# Altium schematic sheet AC_REMOTE.SchDoc
size A3; SheetNumber: 1; SheetTotal: 2
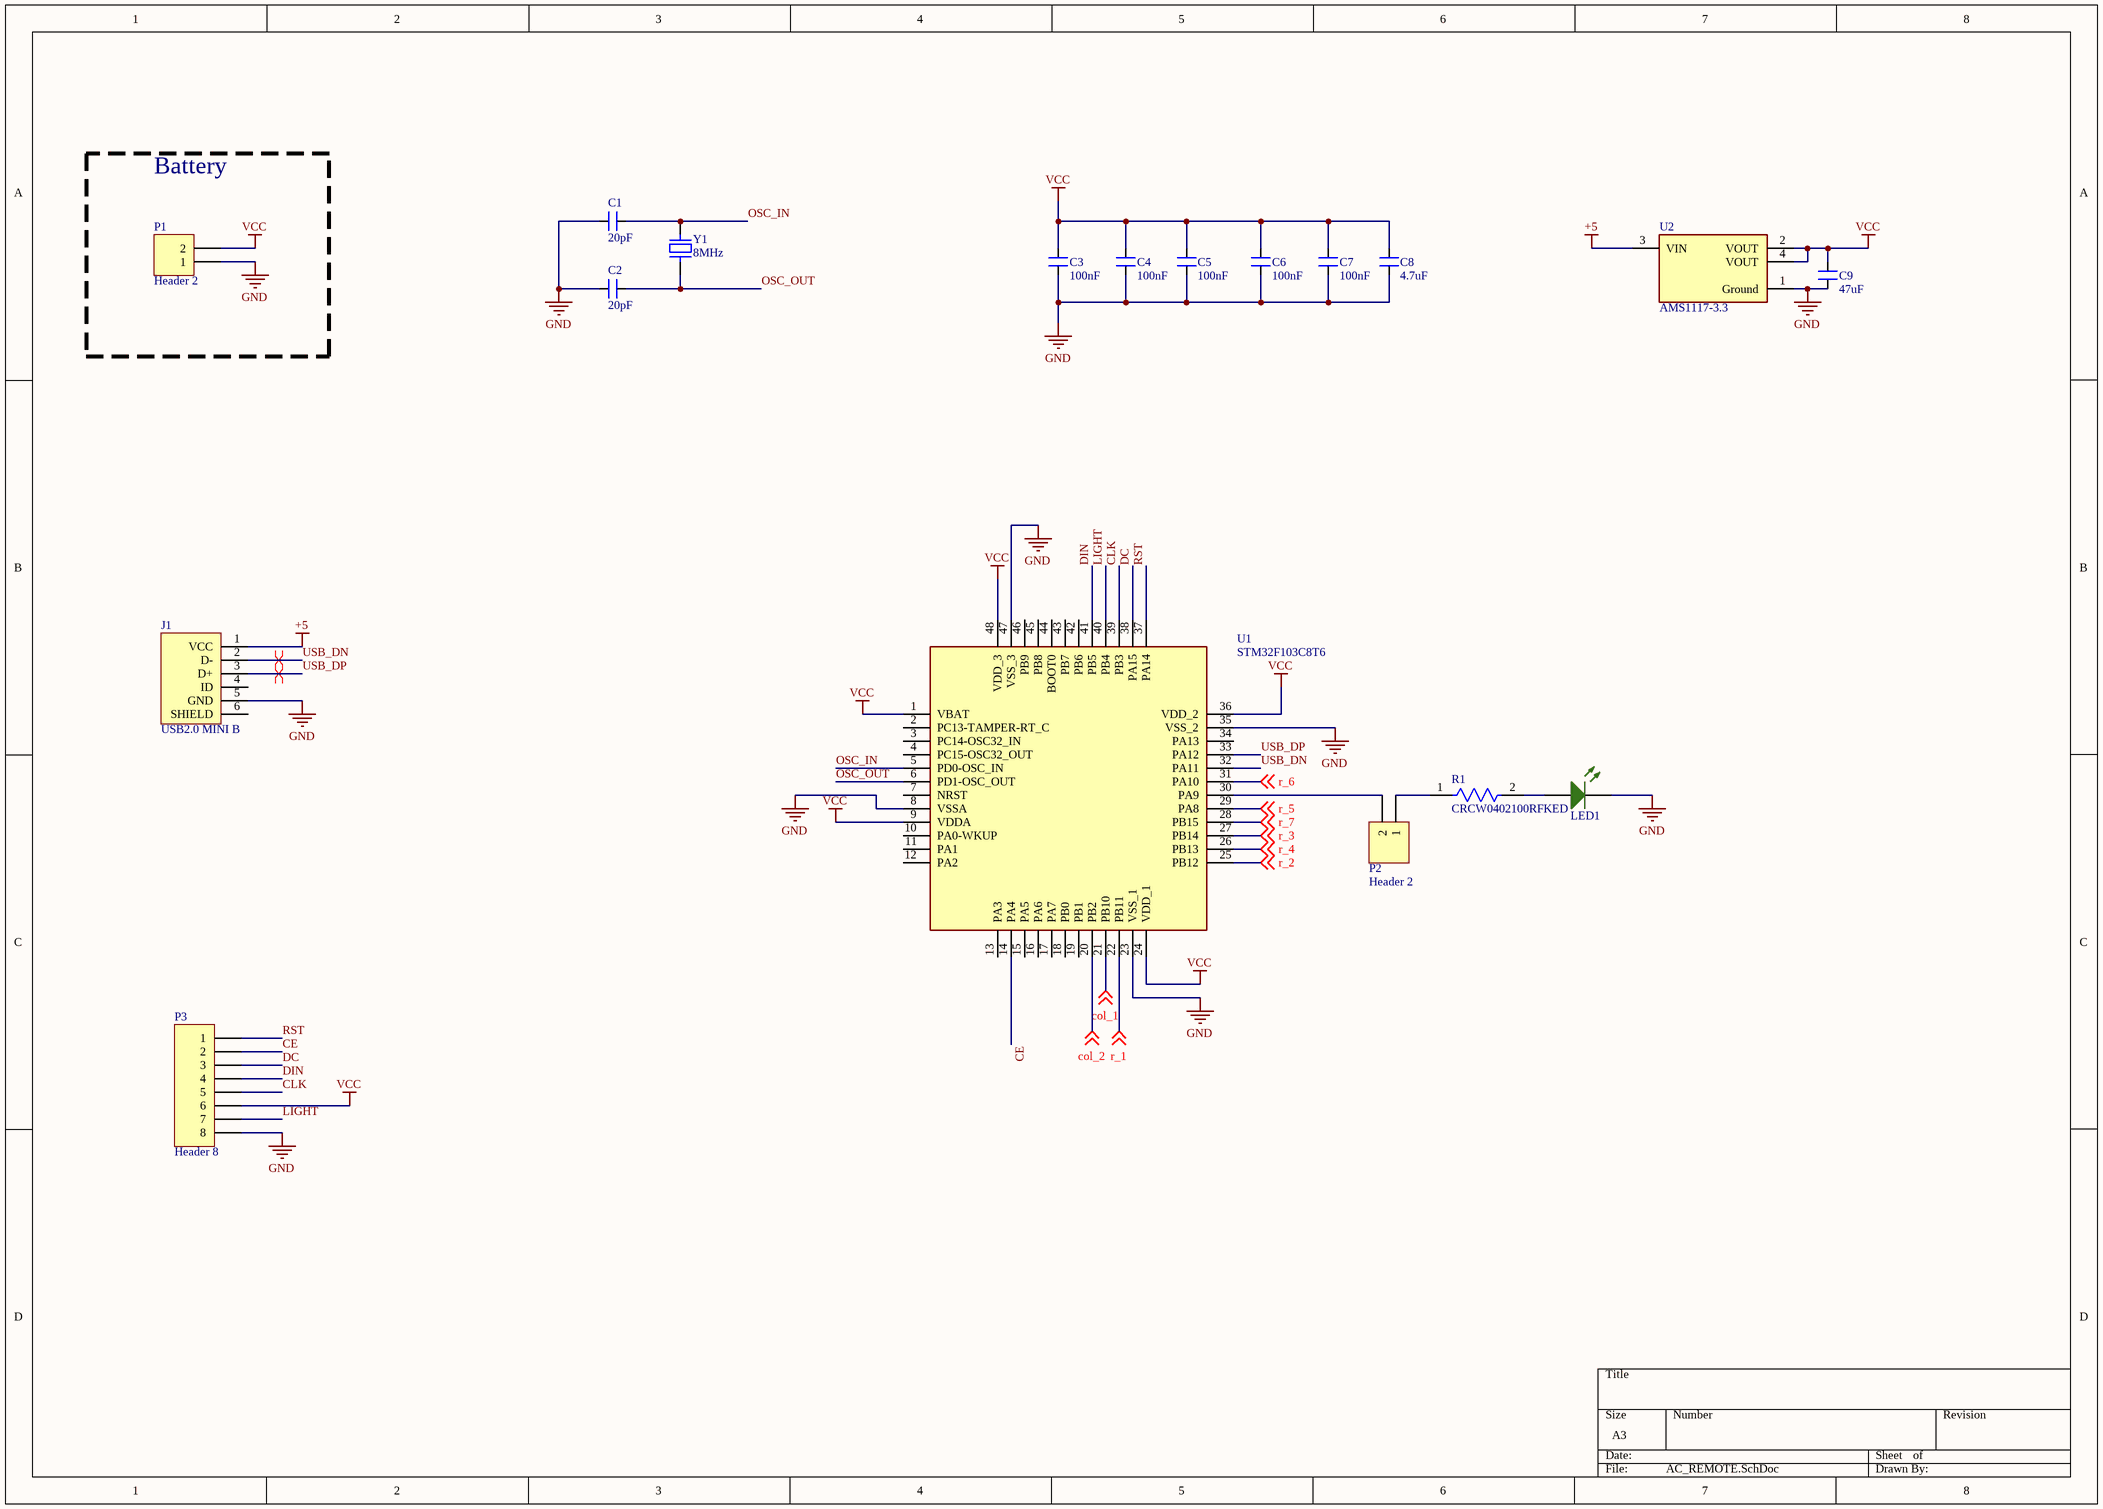
[diagram p0: AC_REMOTE.SchDoc]

## Parts
C1  20pF  [CAP_0805]
C2  20pF  [CAP_0805]
C3  100nF  [CAP_0805]
C4  100nF  [CAP_0805]
C5  100nF  [CAP_0805]
C6  100nF  [CAP_0805]
C7  100nF  [CAP_0805]
C8  4.7uF  [CAP_0805]
C9  47uF  [CAP_0805]
J1  USB2.0 MINI B  [CON_690-005-299-043]
LED1  LED THD 5mm GREEN  [LED_5MM_GREEN]  (value not drawn)
P1  Header 2  [HDR1X2]
P2  Header 2  [HDR1X2]
P3  Header 8  [HDR1X8]
R1  CRCW0402100RFKED  [FP-CRCW0402-e3-IPC_C]
U1  STM32F103C8T6  [LQFP-48_19.6_393_58X11_SMD]
U2  AMS1117-3.3  [FP-AMS1117-IPC_C]
Y1  8MHz  [HC-49S SMD]

## Blocks framed on the sheet
Battery: P1

## Nets
+5: J1.1(VCC) U2.3(VIN)
GND: C1.1 C2.1 C3.1 C4.1 C5.1 C6.1 C7.1 C8.2 C9.1 J1.5(GND) LED1.2(K) P1.1 P3.8 U1.8(VSSA) U1.23(VSS_1) U1.35(VSS_2) U1.47(VSS_3) U2.1(Ground)
VCC: C3.2 C4.2 C5.2 C6.2 C7.2 C8.1 C9.2 P1.2 P3.6 U1.1(VBAT) U1.9(VDDA) U1.24(VDD_1) U1.36(VDD_2) U1.48(VDD_3) U2.2(VOUT) U2.4(VOUT)
CE: P3.2 U1.14(PA4)
CLK: P3.5 U1.39(PB3)
col_1: U1.21(PB10) ; off-sheet col_1
col_2: U1.20(PB2) ; off-sheet col_2
DC: P3.3 U1.38(PA15)
DIN: P3.4 U1.41(PB5)
LIGHT: P3.7 U1.40(PB4)
OSC_IN: C1.2 U1.5(PD0-OSC_IN) Y1.2
OSC_OUT: C2.2 U1.6(PD1-OSC_OUT) Y1.1
r_1: U1.22(PB11) ; off-sheet r_1
r_2: U1.25(PB12) ; off-sheet r_2
r_3: U1.27(PB14) ; off-sheet r_3
r_4: U1.26(PB13) ; off-sheet r_4
r_5: U1.29(PA8) ; off-sheet r_5
r_6: U1.31(PA10) ; off-sheet r_6
r_7: U1.28(PB15) ; off-sheet r_7
RST: P3.1 U1.37(PA14)
USB_DN: J1.2(D-) U1.32(PA11)
USB_DP: J1.3(D+) U1.33(PA12)
NetLED1_1: LED1.1(A) R1.2
NetP2_1: P2.1 R1.1
NetP2_2: P2.2 U1.30(PA9)

Not connected (* = marked no-connect by the designer): J1 4(ID) 6(SHIELD); U1 2(PC13-TAMPER-RT_C) 3(PC14-OSC32_IN) 4(PC15-OSC32_OUT) 7(NRST) 10(PA0-WKUP) 11(PA1) 12(PA2) 13(PA3) 15(PA5) 16(PA6) 17(PA7) 18(PB0) 19(PB1) 34(PA13) 42(PB6) 43(PB7) 44(BOOT0) 45(PB8) 46(PB9)

## Layout directives
differential pair; differential pair class diff90: USB_DN, USB_DP

## Library data of the parts
C1 C2 = CAP_20pF-50V-10%-0805: ±10% 50V Ceramic Capacitor C0G, NP0 0805 (2012 Metric); Manufacturer: AVX Corporation; Manufacturer Part Number: 08055A200KAT2A; Alternate Part Number-1: NA; Case/Package: 0805; Supplier-1: Digikey; Supplier Part Number-1: 478-11887-1-ND - Cut Tape (CT)
C3-C7 = CAP_100pF-50V-5%-0805: 100nF ±5% 50V Ceramic Capacitor C0G, NP0 0805 (2012 Metric); Manufacturer: KEMET; Manufacturer Part Number: CC0805JRNPO9BN101; Alternate Part Number-1: NA; Case/Package: 0805; Supplier-1: SIRICOM; Supplier Part Number-1: 0805N101J500LT
C8 = CAP_4.7uF-50V-10%-0805: 4.7µF ±10% 50V Ceramic Capacitor X5R 0805 (2012 Metric); Manufacturer: Yageo; Manufacturer Part Number: GRM21BR61H475KE51L; Alternate Part Number-1: NA; Case/Package: 0805; Supplier-1: SIRICOM; Supplier Part Number-1: CL21A475KBQNNNE
C9 = CAP_47pF-50V-5%-0805: 47uF ±5% 50V Ceramic Capacitor C0G, NP0 0805 (2012 Metric); Manufacturer: KEMET; Manufacturer Part Number: C0805C470J5GACTU; Alternate Part Number-1: NA; Case/Package: 0805; Supplier-1: SIRICOM; Supplier Part Number-1: 0805N450J500CT
J1 = CON_USB2.0-MINIB-SMD: USB - mini B USB 2.0 Receptacle Connector 5 Position Surface Mount, Right Angle; Manufacturer: EDAC; Manufacturer Part Number: 690-005-299-043; Alternate Part Number-1: NA; Case/Package: USB-MINI-B; Supplier-1: LCSC; Supplier Part Number-1: C105424
P1 P2 = Header 2: Header, 2-Pin; LatestRevisionDate: 17-Jul-2002; LatestRevisionNote: Re-released for DXP Platform.; Publisher: Altium Limited
P3 = Header 8: Header, 8-Pin; LatestRevisionDate: 17-Jul-2002; LatestRevisionNote: Re-released for DXP Platform.; Publisher: Altium Limited
R1 = CMP-1011-00397-3: RES Thick Film, 100Ω, 1%, 0.063W, 100ppm/°C, 0402; Max Power Dissipation: 63mW; Voltage Rating: 50V; Resistance: 100R; Package Quantity: 10; Lead Free: Lead Free; Termination: SMD/SMT; Case Code (Metric): 1005; Number of Terminations: 2; Composition: Thick Film; Voltage Rating (DC): 50V; Min Operating Temperature: -55°C; Case/Package: 0402; Radiation Hardening: No; Max Operating Temperature: 155°C; Temperature Coefficient: 100ppm/°C; Military Standard: Not; Length: 1mm; Mount: Surface Mount; Power Rating: 63mW; Weight: 2.3E-05oz; Working Voltage: 50V; Features: Automotive AEC-Q200; Depth: 0.5mm; Packaging: Tape and Reel; Tolerance: 1%; Height: 0.35mm; Case Code (Imperial): 0402; Width: 0.02inch; Contact Plating: Tin
U1 = IC_STM32F103C8T6: ARM® Cortex®-M3 STM32F1 Microcontroller IC 32-Bit 72MHz 64KB (64K x 8) FLASH 48-LQFP (7x7); Manufacturer: STMicroelectronics; Alternate Part Number-1: NA; Manufacturer Part Number: STM32F103C8T6; Case/Package: LQFP48; Supplier-1: LCSC; Supplier Part Number-1: STM32F103C8T6
U2 = CMP-209535-000001-1: LDO Voltage Regulators 1A, 3.3V; Manufacturer: Advanced Monolithic Systems; Dropout Voltage: 1.1V; Output Type: Fixed; Nominal Supply Current: 5mA; Max Power Dissipation: 1.2W; Max Supply Voltage: 15V; Number Of Outputs: 1; Standoff Height: 0.64mm; Max Junction Temp: +125°C; Height: 1.8mm; Package: AMS1117; Device Class L2: Power Management ICs; ComponentLink2Description: Datasheet; ComponentLink2URL: http://www.advanced-monolithic.com/pdf/ds1117.pdf; Category: IC; RoHS: TRUE; Automotive: No; Device Class L1: Integrated Circuits (ICs); Output Current: 1A; Device Class L3: Voltage Regulators - Linear; Temperature: -40°C to +125°C; Output Voltage: 3.3V; Manufacturer Part Number: AMS1117-3.3; Temperature Range Low: -40°C; Octopart: https://octopart.com/ams1117-3.3-advanced+monolithic+systems-25899300; Lead Free: Yes; Ipc Land Pattern Name: SOT229P700X180-4; Temperature Range High: +125°C
Y1 = Crystal HC-49S SMD 8MHz: SMT Crystal; PartNumber: ABLS-8.000MHZ-K4T